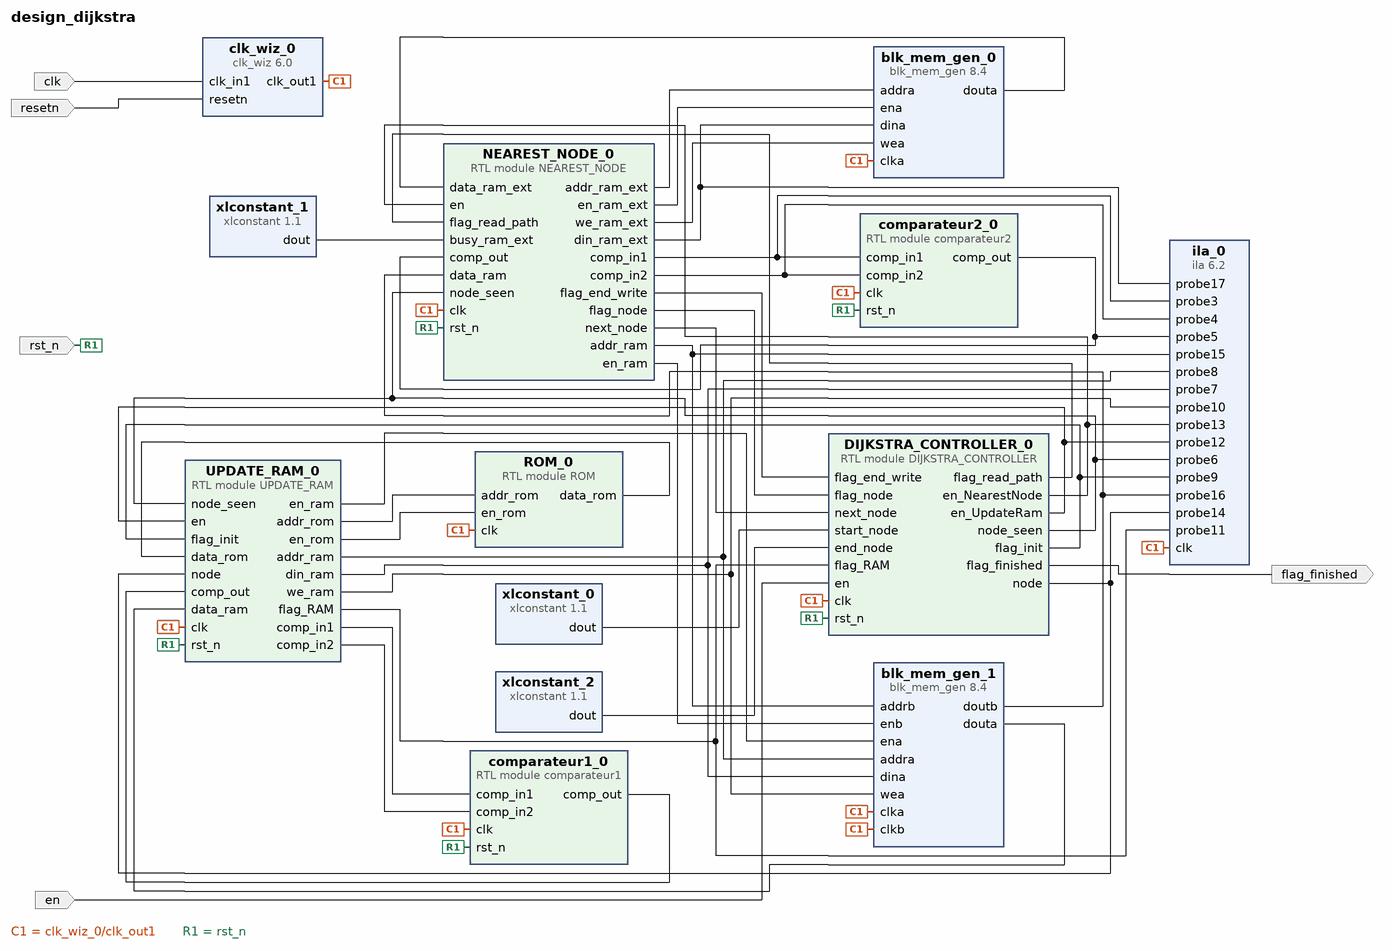
[diagram p0: block diagram of the top level]
# Vivado block design design_dijkstra, xc7z020clg400-1, Vivado 2020.2
create_bd_design design_dijkstra

create_bd_port -dir I -type clk clk
create_bd_port -dir I en
create_bd_port -dir O flag_finished
create_bd_port -dir I -type rst resetn
create_bd_port -dir I -type rst rst_n

create_bd_cell -type ip -vlnv xilinx.com:ip:blk_mem_gen:8.4 blk_mem_gen_0
set_property -dict [list \
  CONFIG.Enable_32bit_Address false \
  CONFIG.Read_Width_A 16 \
  CONFIG.Register_PortA_Output_of_Memory_Primitives false \
  CONFIG.Use_Byte_Write_Enable false \
  CONFIG.Use_RSTA_Pin false \
  CONFIG.Write_Depth_A 256 \
  CONFIG.Write_Width_A 16 \
  CONFIG.use_bram_block Stand_Alone \
] [get_bd_cells blk_mem_gen_0]
create_bd_cell -type ip -vlnv xilinx.com:ip:clk_wiz:6.0 clk_wiz_0
set_property -dict [list \
  CONFIG.CLKOUT1_DRIVES BUFG \
  CONFIG.CLKOUT1_JITTER 203.457 \
  CONFIG.CLKOUT1_PHASE_ERROR 155.540 \
  CONFIG.CLKOUT1_REQUESTED_OUT_FREQ 50 \
  CONFIG.CLKOUT2_DRIVES BUFG \
  CONFIG.CLKOUT3_DRIVES BUFG \
  CONFIG.CLKOUT4_DRIVES BUFG \
  CONFIG.CLKOUT5_DRIVES BUFG \
  CONFIG.CLKOUT6_DRIVES BUFG \
  CONFIG.CLKOUT7_DRIVES BUFG \
  CONFIG.JITTER_SEL No_Jitter \
  CONFIG.MMCM_BANDWIDTH OPTIMIZED \
  CONFIG.MMCM_CLKFBOUT_MULT_F 17 \
  CONFIG.MMCM_CLKOUT0_DIVIDE_F 17 \
  CONFIG.MMCM_CLKOUT0_DUTY_CYCLE 0.5 \
  CONFIG.MMCM_COMPENSATION ZHOLD \
  CONFIG.MMCM_DIVCLK_DIVIDE 2 \
  CONFIG.PRIMITIVE PLL \
  CONFIG.RESET_PORT resetn \
  CONFIG.RESET_TYPE ACTIVE_LOW \
  CONFIG.USE_MIN_POWER true \
] [get_bd_cells clk_wiz_0]
create_bd_cell -type ip -vlnv xilinx.com:ip:ila:6.2 ila_0
set_property -dict [list \
  CONFIG.C_DATA_DEPTH 16384 \
  CONFIG.C_ENABLE_ILA_AXI_MON false \
  CONFIG.C_MONITOR_TYPE Native \
  CONFIG.C_NUM_OF_PROBES 18 \
  CONFIG.C_PROBE0_WIDTH 2 \
  CONFIG.C_PROBE14_WIDTH 10 \
  CONFIG.C_PROBE15_WIDTH 5 \
  CONFIG.C_PROBE16_WIDTH 10 \
  CONFIG.C_PROBE17_WIDTH 16 \
  CONFIG.C_PROBE1_WIDTH 2 \
  CONFIG.C_PROBE2_WIDTH 3 \
  CONFIG.C_PROBE3_WIDTH 10 \
  CONFIG.C_PROBE4_WIDTH 10 \
  CONFIG.C_PROBE5_WIDTH 10 \
  CONFIG.C_PROBE6_WIDTH 17 \
  CONFIG.C_PROBE7_WIDTH 10 \
  CONFIG.C_PROBE8_WIDTH 5 \
  CONFIG.C_TRIGIN_EN false \
] [get_bd_cells ila_0]
create_bd_cell -type ip -vlnv xilinx.com:ip:xlconstant:1.1 xlconstant_0
set_property -dict {CONFIG.CONST_VAL 6 CONFIG.CONST_WIDTH 5} [get_bd_cells xlconstant_0]
create_bd_cell -type ip -vlnv xilinx.com:ip:xlconstant:1.1 xlconstant_1
set_property -dict {CONFIG.CONST_VAL 0} [get_bd_cells xlconstant_1]
create_bd_cell -type ip -vlnv xilinx.com:ip:xlconstant:1.1 xlconstant_2
set_property -dict {CONFIG.CONST_VAL 16 CONFIG.CONST_WIDTH 5} [get_bd_cells xlconstant_2]
create_bd_cell -type ip -vlnv xilinx.com:ip:blk_mem_gen:8.4 blk_mem_gen_1
set_property -dict [list \
  CONFIG.Enable_32bit_Address false \
  CONFIG.Enable_B Use_ENB_Pin \
  CONFIG.Memory_Type True_Dual_Port_RAM \
  CONFIG.Port_B_Clock 100 \
  CONFIG.Port_B_Enable_Rate 100 \
  CONFIG.Port_B_Write_Rate 50 \
  CONFIG.Read_Width_A 10 \
  CONFIG.Read_Width_B 10 \
  CONFIG.Register_PortA_Output_of_Memory_Primitives false \
  CONFIG.Register_PortB_Output_of_Memory_Primitives false \
  CONFIG.Use_Byte_Write_Enable false \
  CONFIG.Use_RSTA_Pin false \
  CONFIG.Write_Depth_A 32 \
  CONFIG.Write_Width_A 10 \
  CONFIG.Write_Width_B 10 \
  CONFIG.use_bram_block Stand_Alone \
] [get_bd_cells blk_mem_gen_1]
create_bd_cell -type module -reference ROM ROM_0
create_bd_cell -type module -reference comparateur1 comparateur1_0
create_bd_cell -type module -reference comparateur2 comparateur2_0
create_bd_cell -type module -reference NEAREST_NODE NEAREST_NODE_0
create_bd_cell -type module -reference DIJKSTRA_CONTROLLER DIJKSTRA_CONTROLLER_0
create_bd_cell -type module -reference UPDATE_RAM UPDATE_RAM_0

# ---- connections ----

connect_bd_net [get_bd_pins DIJKSTRA_CONTROLLER_0/en_NearestNode] [get_bd_pins ila_0/probe13] [get_bd_pins NEAREST_NODE_0/en]
connect_bd_net [get_bd_pins DIJKSTRA_CONTROLLER_0/en_UpdateRam] [get_bd_pins ila_0/probe12] [get_bd_pins UPDATE_RAM_0/en]
connect_bd_net [get_bd_pins DIJKSTRA_CONTROLLER_0/flag_finished] [get_bd_ports flag_finished]
connect_bd_net [get_bd_pins DIJKSTRA_CONTROLLER_0/flag_init] [get_bd_pins ila_0/probe9] [get_bd_pins UPDATE_RAM_0/flag_init]
connect_bd_net [get_bd_pins DIJKSTRA_CONTROLLER_0/flag_read_path] [get_bd_pins NEAREST_NODE_0/flag_read_path]
connect_bd_net [get_bd_pins DIJKSTRA_CONTROLLER_0/node] [get_bd_pins ila_0/probe14] [get_bd_pins UPDATE_RAM_0/node]
connect_bd_net [get_bd_pins DIJKSTRA_CONTROLLER_0/node_seen] \
  [get_bd_pins ila_0/probe6] [get_bd_pins NEAREST_NODE_0/node_seen] [get_bd_pins UPDATE_RAM_0/node_seen]
connect_bd_net [get_bd_pins NEAREST_NODE_0/addr_ram] [get_bd_pins ila_0/probe15] [get_bd_pins blk_mem_gen_1/addrb]
connect_bd_net [get_bd_pins NEAREST_NODE_0/addr_ram_ext] [get_bd_pins blk_mem_gen_0/addra]
connect_bd_net [get_bd_pins NEAREST_NODE_0/comp_in1] [get_bd_pins ila_0/probe3] [get_bd_pins comparateur2_0/comp_in1]
connect_bd_net [get_bd_pins NEAREST_NODE_0/comp_in2] [get_bd_pins ila_0/probe4] [get_bd_pins comparateur2_0/comp_in2]
connect_bd_net [get_bd_pins NEAREST_NODE_0/din_ram_ext] [get_bd_pins blk_mem_gen_0/dina] [get_bd_pins ila_0/probe17]
connect_bd_net [get_bd_pins NEAREST_NODE_0/en_ram_ext] [get_bd_pins blk_mem_gen_0/ena]
connect_bd_net [get_bd_pins NEAREST_NODE_0/flag_end_write] [get_bd_pins DIJKSTRA_CONTROLLER_0/flag_end_write]
connect_bd_net [get_bd_pins NEAREST_NODE_0/flag_node] [get_bd_pins DIJKSTRA_CONTROLLER_0/flag_node]
connect_bd_net [get_bd_pins NEAREST_NODE_0/next_node] [get_bd_pins DIJKSTRA_CONTROLLER_0/next_node]
connect_bd_net [get_bd_pins NEAREST_NODE_0/we_ram_ext] [get_bd_pins blk_mem_gen_0/wea]
connect_bd_net [get_bd_pins ROM_0/data_rom] [get_bd_pins UPDATE_RAM_0/data_rom]
connect_bd_net [get_bd_pins UPDATE_RAM_0/addr_ram] [get_bd_pins ila_0/probe8] [get_bd_pins blk_mem_gen_1/addra]
connect_bd_net [get_bd_pins UPDATE_RAM_0/addr_rom] [get_bd_pins ROM_0/addr_rom]
connect_bd_net [get_bd_pins UPDATE_RAM_0/comp_in1] [get_bd_pins comparateur1_0/comp_in1]
connect_bd_net [get_bd_pins UPDATE_RAM_0/comp_in2] [get_bd_pins comparateur1_0/comp_in2]
connect_bd_net [get_bd_pins UPDATE_RAM_0/din_ram] [get_bd_pins ila_0/probe7] [get_bd_pins blk_mem_gen_1/dina]
connect_bd_net [get_bd_pins UPDATE_RAM_0/en_rom] [get_bd_pins ROM_0/en_rom]
connect_bd_net [get_bd_pins UPDATE_RAM_0/flag_RAM] [get_bd_pins ila_0/probe11] [get_bd_pins DIJKSTRA_CONTROLLER_0/flag_RAM]
connect_bd_net [get_bd_pins UPDATE_RAM_0/we_ram] [get_bd_pins ila_0/probe10] [get_bd_pins blk_mem_gen_1/wea]
connect_bd_net [get_bd_pins blk_mem_gen_0/douta] [get_bd_pins NEAREST_NODE_0/data_ram_ext]
connect_bd_net -net clk_0_1 [get_bd_pins clk_wiz_0/clk_out1] \
  [get_bd_pins blk_mem_gen_0/clka] [get_bd_pins ila_0/clk] [get_bd_pins blk_mem_gen_1/clkb] [get_bd_pins blk_mem_gen_1/clka] \
  [get_bd_pins ROM_0/clk] [get_bd_pins comparateur1_0/clk] [get_bd_pins comparateur2_0/clk] [get_bd_pins NEAREST_NODE_0/clk] \
  [get_bd_pins DIJKSTRA_CONTROLLER_0/clk] [get_bd_pins UPDATE_RAM_0/clk]
connect_bd_net [get_bd_ports clk] [get_bd_pins clk_wiz_0/clk_in1]
connect_bd_net [get_bd_pins comparateur1_0/comp_out] [get_bd_pins UPDATE_RAM_0/comp_out]
connect_bd_net [get_bd_pins comparateur2_0/comp_out] [get_bd_pins ila_0/probe5] [get_bd_pins NEAREST_NODE_0/comp_out]
connect_bd_net -net dpram_0_data_out_b [get_bd_pins blk_mem_gen_1/doutb] [get_bd_pins ila_0/probe16] [get_bd_pins NEAREST_NODE_0/data_ram]
connect_bd_net -net en_0_1 [get_bd_ports en] [get_bd_pins DIJKSTRA_CONTROLLER_0/en]
connect_bd_net -net resetn_0_1 [get_bd_ports resetn] [get_bd_pins clk_wiz_0/resetn]
connect_bd_net -net rst_n_0_1 [get_bd_ports rst_n] \
  [get_bd_pins comparateur1_0/rst_n] [get_bd_pins comparateur2_0/rst_n] [get_bd_pins NEAREST_NODE_0/rst_n] \
  [get_bd_pins DIJKSTRA_CONTROLLER_0/rst_n] [get_bd_pins UPDATE_RAM_0/rst_n]
connect_bd_net [get_bd_pins xlconstant_0/dout] [get_bd_pins DIJKSTRA_CONTROLLER_0/start_node]
connect_bd_net [get_bd_pins xlconstant_1/dout] [get_bd_pins NEAREST_NODE_0/busy_ram_ext]
connect_bd_net [get_bd_pins xlconstant_2/dout] [get_bd_pins DIJKSTRA_CONTROLLER_0/end_node]
connect_bd_net [get_bd_pins NEAREST_NODE_0/en_ram] [get_bd_pins blk_mem_gen_1/enb]
connect_bd_net [get_bd_pins UPDATE_RAM_0/en_ram] [get_bd_pins blk_mem_gen_1/ena]
connect_bd_net [get_bd_pins blk_mem_gen_1/douta] [get_bd_pins UPDATE_RAM_0/data_ram]

validate_bd_design
save_bd_design
